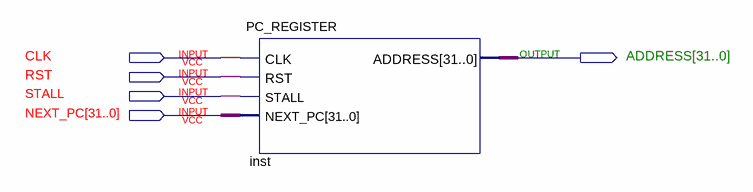
[diagram p0: schematic sheet]
// Quartus schematic PC_REGISTERTEST.bdf as structural Verilog: 1 symbols, 5 pins
module PC_REGISTERTEST (
  input  CLK,
  input  RST,
  input  STALL,
  input  [31:0] NEXT_PC,
  output [31:0] ADDRESS
);

  PC_REGISTER inst (.CLK(CLK), .RST(RST), .STALL(STALL), .NEXT_PC(NEXT_PC), .ADDRESS(ADDRESS));
endmodule
